# EAGLE design drums (EAGLE 9.6.2)
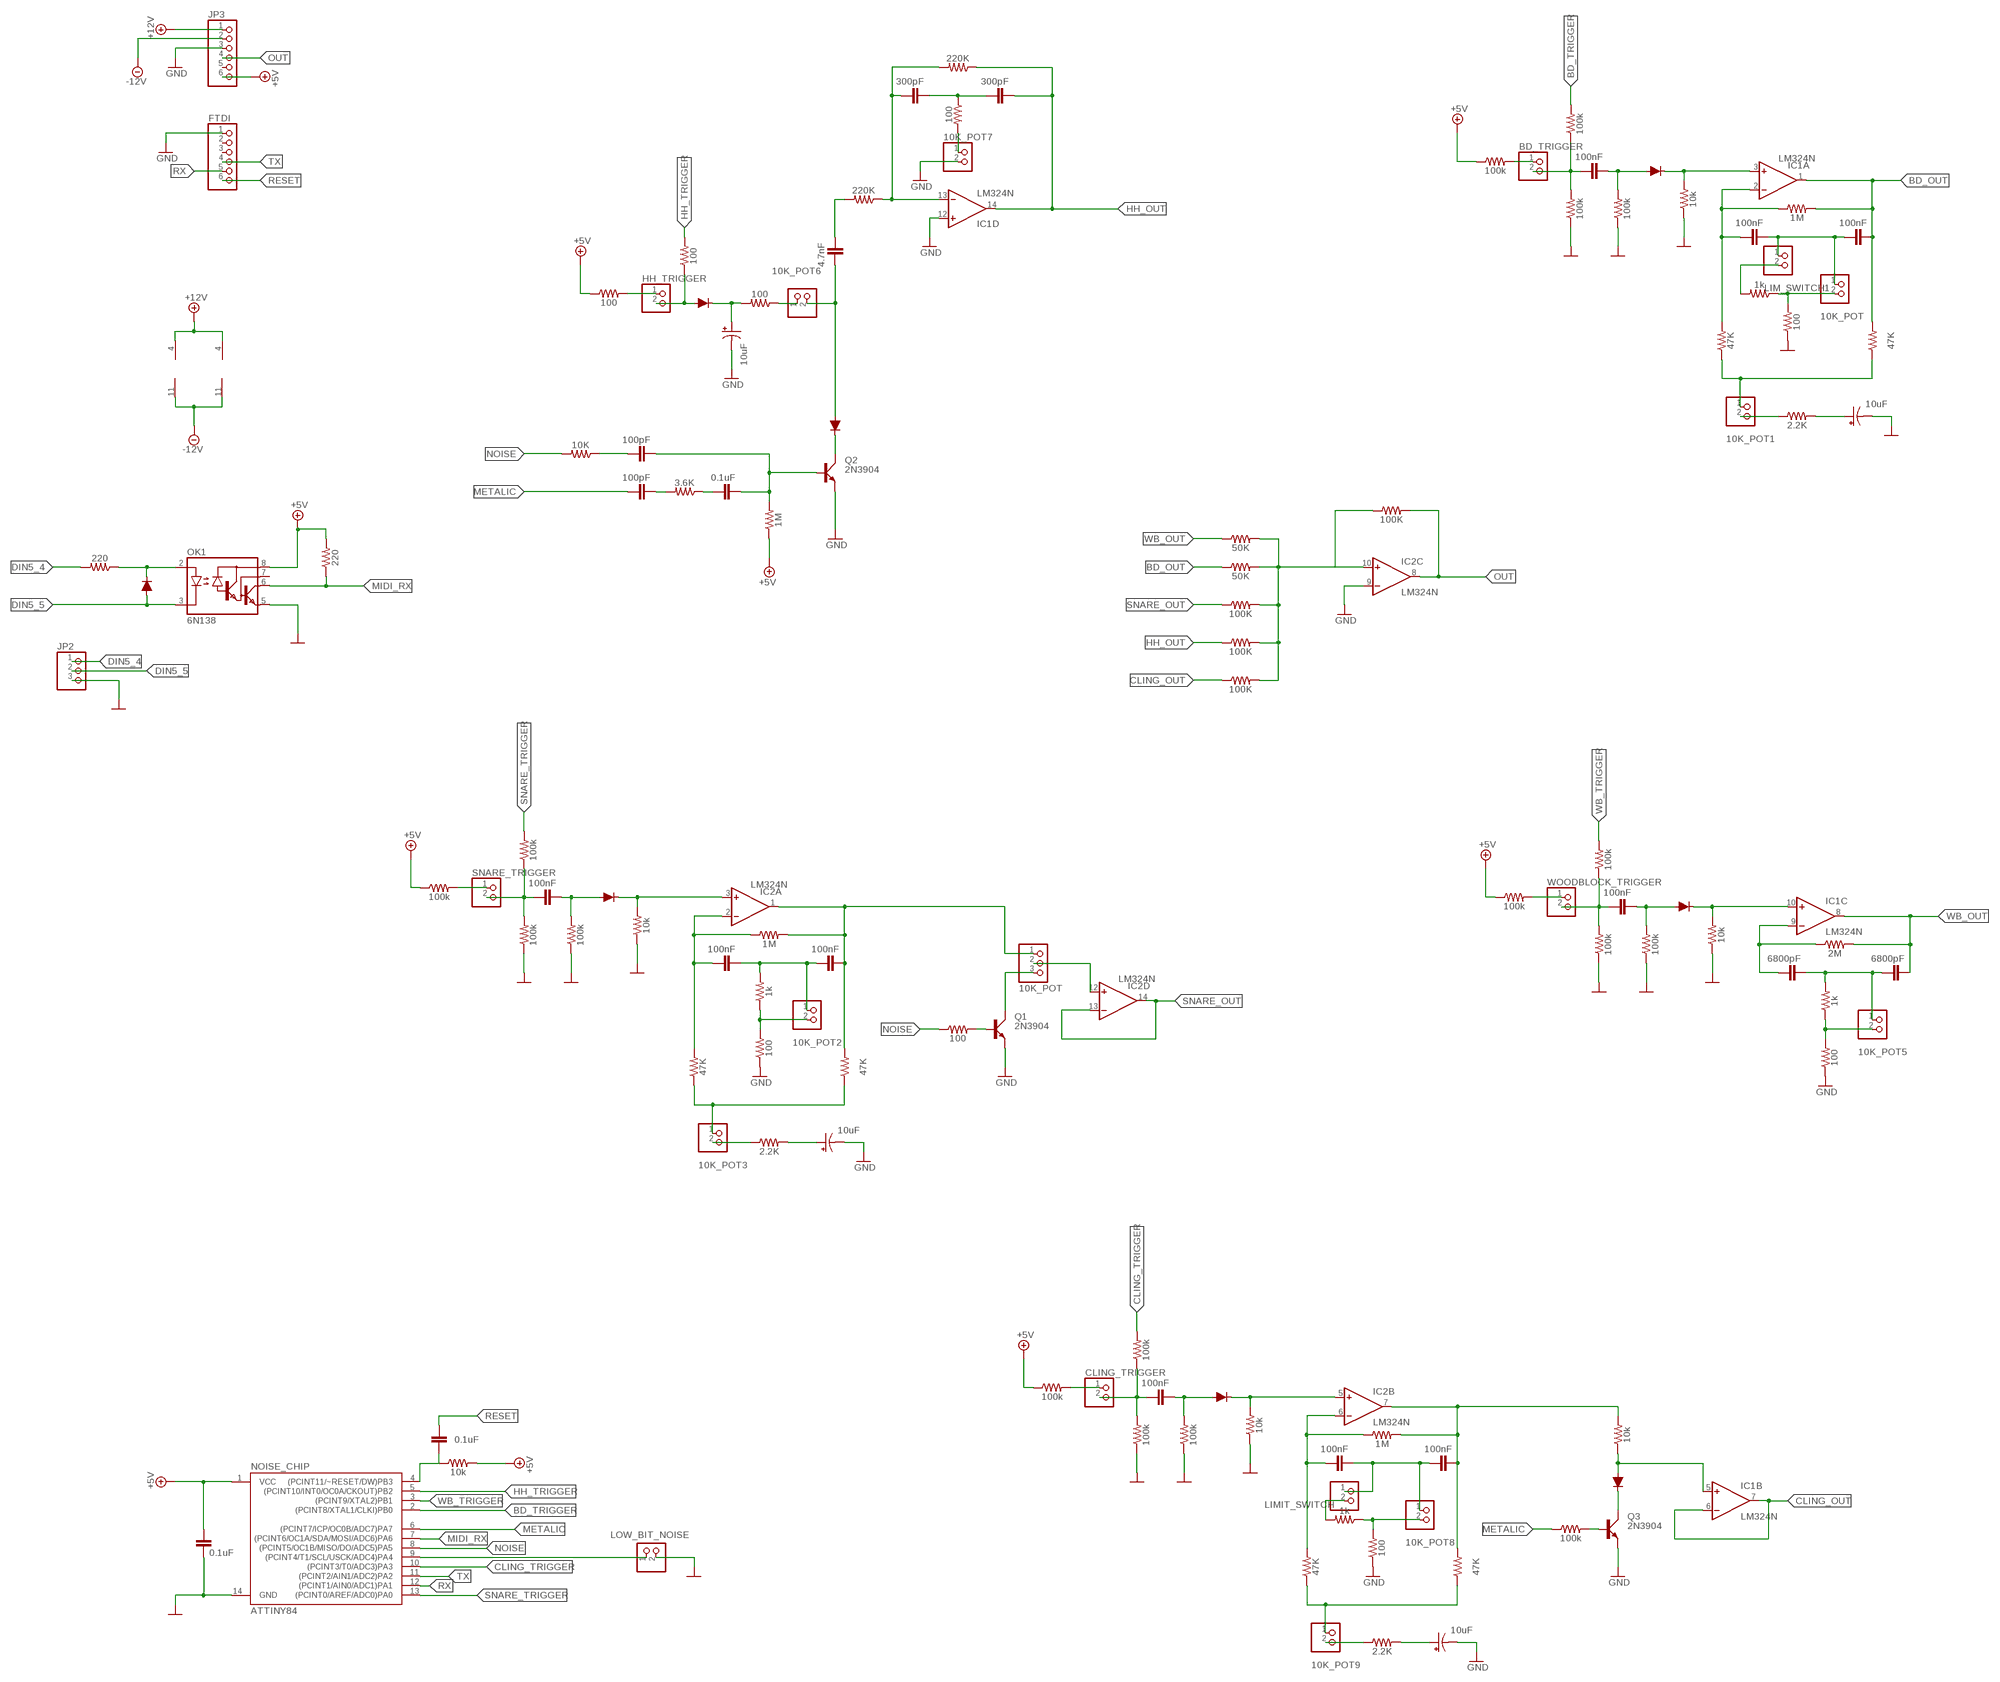
[diagram p0: schematic, sheet 1]

## Parts
1M  1M  100KOHM-HORIZ-1/4W-5%  [AXIAL-0.3]
1M1  220  100KOHM-HORIZ-1/4W-5%  [AXIAL-0.3]
1M2  220  100KOHM-HORIZ-1/4W-5%  [AXIAL-0.3]
10K_POT  PINHD-1X2  [1X02]
10K_POT1  PINHD-1X2  [1X02]
10K_POT2  PINHD-1X2  [1X02]
10K_POT3  PINHD-1X2  [1X02]
10K_POT4  10K_POT  PINHD-1X3  [1X03]
10K_POT5  PINHD-1X2  [1X02]
10K_POT6  PINHD-1X2  [1X02]
10K_POT7  PINHD-1X2  [1X02]
10K_POT8  PINHD-1X2  [1X02]
10K_POT9  PINHD-1X2  [1X02]
BD_TRIGGER  PINHD-1X2  [1X02]
C1  0.1uF  C5/3  [C5B3]
C2  100nF  C5/3  [C5B3]
C3  100nF  C5/3  [C5B3]
C4  0.1uF  C5/3  [C5B3]
C5  10uF  CPOL-USTT5D11  [TT5D11]
C6  100nF  C5/3  [C5B3]
C7  100nF  C5/3  [C5B3]
C8  10uF  CPOL-USTT5D11  [TT5D11]
C9  6800pF  C5/3  [C5B3]
C10  6800pF  C5/3  [C5B3]
C11  10uF  CPOL-USTT5D11  [TT5D11]
C12  0.1uF  C5/3  [C5B3]
C13  100pF  C5/3  [C5B3]
C14  100pF  C5/3  [C5B3]
C15  4.7nF  C5/3  [C5B3]
C16  300pF  C5/3  [C5B3]
C17  300pF  C5/3  [C5B3]
C18  100nF  C5/3  [C5B3]
C19  100nF  C5/3  [C5B3]
C20  100nF  C5/3  [C5B3]
C21  100nF  C5/3  [C5B3]
C22  100nF  C5/3  [C5B3]
C23  10uF  CPOL-USTT5D11  [TT5D11]
C24  100nF  C5/3  [C5B3]
CLING_TRIGGER  PINHD-1X2  [1X02]
D1  1A/50V/1.1V  DIODE-KIT2  [DIODE-1N4001-KIT]
D2  1A/50V/1.1V  DIODE-KIT2  [DIODE-1N4001-KIT]
D3  1A/50V/1.1V  DIODE-KIT2  [DIODE-1N4001-KIT]
D4  1A/50V/1.1V  DIODE-KIT2  [DIODE-1N4001-KIT]
D5  1A/50V/1.1V  DIODE-KIT2  [DIODE-1N4001-KIT]
D6  1A/50V/1.1V  DIODE-KIT2  [DIODE-1N4001-KIT]
D7  1A/50V/1.1V  DIODE-KIT2  [DIODE-1N4001-KIT]
D8  1A/50V/1.1V  DIODE-KIT2  [DIODE-1N4001-KIT]
FTDI  PINHD-1X6  [1X06]
HH_TRIGGER  PINHD-1X2  [1X02]
IC1  LM324N  [DIL14]
IC2  LM324N  [DIL14]
JP2  PINHD-1X3  [1X03]
JP3  PINHD-1X6  [1X06]
LIM_SWITCH1  PINHD-1X2  [1X02]
LIMIT_SWITCH  PINHD-1X2  [1X02]
LOW_BIT_NOISE  PINHD-1X2  [1X02]
NOISE_CHIP  ATTINY84  ATTINY84ATTINY84-20PU  [DIP14]
OK1  6N138  [DIL08]
Q1  2N3904  [TO92D]
Q2  2N3904  [TO92D]
Q3  2N3904  [TO92D]
R1  100k  100KOHM-HORIZ-1/4W-5%  [AXIAL-0.3]
R2  10k  100KOHM-HORIZ-1/4W-5%  [AXIAL-0.3]
R3  1M  100KOHM-HORIZ-1/4W-5%  [AXIAL-0.3]
R4  47K  100KOHM-HORIZ-1/4W-5%  [AXIAL-0.3]
R5  47K  100KOHM-HORIZ-1/4W-5%  [AXIAL-0.3]
R6  1k  100KOHM-HORIZ-1/4W-5%  [AXIAL-0.3]
R7  100  100KOHM-HORIZ-1/4W-5%  [AXIAL-0.3]
R8  2.2K  100KOHM-HORIZ-1/4W-5%  [AXIAL-0.3]
R9  50K  100KOHM-HORIZ-1/4W-5%  [AXIAL-0.3]
R10  100K  100KOHM-HORIZ-1/4W-5%  [AXIAL-0.3]
R11  100  100KOHM-HORIZ-1/4W-5%  [AXIAL-0.3]
R12  100k  100KOHM-HORIZ-1/4W-5%  [AXIAL-0.3]
R13  1M  100KOHM-HORIZ-1/4W-5%  [AXIAL-0.3]
R14  47K  100KOHM-HORIZ-1/4W-5%  [AXIAL-0.3]
R15  47K  100KOHM-HORIZ-1/4W-5%  [AXIAL-0.3]
R16  1k  100KOHM-HORIZ-1/4W-5%  [AXIAL-0.3]
R17  100  100KOHM-HORIZ-1/4W-5%  [AXIAL-0.3]
R18  2.2K  100KOHM-HORIZ-1/4W-5%  [AXIAL-0.3]
R19  100k  100KOHM-HORIZ-1/4W-5%  [AXIAL-0.3]
R20  100k  100KOHM-HORIZ-1/4W-5%  [AXIAL-0.3]
R21  100  100KOHM-HORIZ-1/4W-5%  [AXIAL-0.3]
R22  10k  100KOHM-HORIZ-1/4W-5%  [AXIAL-0.3]
R23  100k  100KOHM-HORIZ-1/4W-5%  [AXIAL-0.3]
R24  2M  100KOHM-HORIZ-1/4W-5%  [AXIAL-0.3]
R25  10k  100KOHM-HORIZ-1/4W-5%  [AXIAL-0.3]
R26  100  100KOHM-HORIZ-1/4W-5%  [AXIAL-0.3]
R27  1k  100KOHM-HORIZ-1/4W-5%  [AXIAL-0.3]
R28  100  100KOHM-HORIZ-1/4W-5%  [AXIAL-0.3]
R29  100  100KOHM-HORIZ-1/4W-5%  [AXIAL-0.3]
R30  100K  100KOHM-HORIZ-1/4W-5%  [AXIAL-0.3]
R31  50K  100KOHM-HORIZ-1/4W-5%  [AXIAL-0.3]
R32  3.6K  100KOHM-HORIZ-1/4W-5%  [AXIAL-0.3]
R33  10K  100KOHM-HORIZ-1/4W-5%  [AXIAL-0.3]
R34  220K  100KOHM-HORIZ-1/4W-5%  [AXIAL-0.3]
R35  220K  100KOHM-HORIZ-1/4W-5%  [AXIAL-0.3]
R36  100  100KOHM-HORIZ-1/4W-5%  [AXIAL-0.3]
R37  100K  100KOHM-HORIZ-1/4W-5%  [AXIAL-0.3]
R38  100k  100KOHM-HORIZ-1/4W-5%  [AXIAL-0.3]
R39  100k  100KOHM-HORIZ-1/4W-5%  [AXIAL-0.3]
R40  10k  100KOHM-HORIZ-1/4W-5%  [AXIAL-0.3]
R41  100k  100KOHM-HORIZ-1/4W-5%  [AXIAL-0.3]
R42  100k  100KOHM-HORIZ-1/4W-5%  [AXIAL-0.3]
R43  100k  100KOHM-HORIZ-1/4W-5%  [AXIAL-0.3]
R44  100k  100KOHM-HORIZ-1/4W-5%  [AXIAL-0.3]
R45  100k  100KOHM-HORIZ-1/4W-5%  [AXIAL-0.3]
R46  1M  100KOHM-HORIZ-1/4W-5%  [AXIAL-0.3]
R47  47K  100KOHM-HORIZ-1/4W-5%  [AXIAL-0.3]
R48  47K  100KOHM-HORIZ-1/4W-5%  [AXIAL-0.3]
R49  1k  100KOHM-HORIZ-1/4W-5%  [AXIAL-0.3]
R50  100  100KOHM-HORIZ-1/4W-5%  [AXIAL-0.3]
R51  2.2K  100KOHM-HORIZ-1/4W-5%  [AXIAL-0.3]
R52  100k  100KOHM-HORIZ-1/4W-5%  [AXIAL-0.3]
R53  10k  100KOHM-HORIZ-1/4W-5%  [AXIAL-0.3]
R54  100k  100KOHM-HORIZ-1/4W-5%  [AXIAL-0.3]
R55  100k  100KOHM-HORIZ-1/4W-5%  [AXIAL-0.3]
R56  100k  100KOHM-HORIZ-1/4W-5%  [AXIAL-0.3]
R57  100k  100KOHM-HORIZ-1/4W-5%  [AXIAL-0.3]
R58  100K  100KOHM-HORIZ-1/4W-5%  [AXIAL-0.3]
R59  10k  100KOHM-HORIZ-1/4W-5%  [AXIAL-0.3]
SNARE_TRIGGER  PINHD-1X2  [1X02]
WOODBLOCK_TRIGGER  PINHD-1X2  [1X02]

## Nets
10K_POT1: 10K_POT1.1 R4.P$1 R5.P$1
10K_POT2: 10K_POT3.1 R14.P$1 R15.P$1
10K_POT3: 10K_POT9.1 R47.P$1 R48.P$1
+5V: 1M1.P$2 1M.P$1 C1.1 JP3.6 NOISE_CHIP.1(VCC) OK1.8(VCC) R23.P$1 R25.P$2 R29.P$1 R38.P$1 R41.P$1 R54.P$1
+12V: IC1.4(P:V+) IC2.4(P:V+) JP3.1
-12V: IC1.11(P:V-) IC2.11(P:V-) JP3.2
BD_OUT: 10K_POT4.1 C3.2 C7.2 IC1.1(A:OUT) IC2.1(A:OUT) R3.P$2 R5.P$2 R13.P$2 R15.P$2 R31.P$1
BD_OUT1: C22.2 IC2.7(B:OUT) R46.P$2 R48.P$2 R59.P$2
BD_TRIGGER: NOISE_CHIP.2((PCINT8/XTAL1/CLKI)PB0) R12.P$2
CLING_OUT: IC1.6(B:-IN) IC1.7(B:OUT) R58.P$1
CLING_TRIGGER: NOISE_CHIP.10((PCINT3/T0/ADC3)PA3) R57.P$2
DIN5_4: 1M2.P$2 JP2.1
DIN5_5: D2.A JP2.2 OK1.3(C)
GND: 10K_POT7.2 C1.2 C5.- C8.- C11.- C23.- FTDI.1 IC1.12(D:+IN) IC2.9(C:-IN) JP2.3 JP3.3 LOW_BIT_NOISE.2 NOISE_CHIP.14(GND) OK1.5(GND) Q1.E Q2.E Q3.E R1.P$1 R2.P$1 R7.P$1 R17.P$1 R22.P$1 R28.P$1 R39.P$1 R40.P$1 R42.P$1 R43.P$1 R44.P$1 R45.P$1 R50.P$1 R53.P$1 R55.P$1 R56.P$1
HH_OUT: C17.2 IC1.14(D:OUT) R35.P$1 R37.P$1
HH_TRIGGER: NOISE_CHIP.5((PCINT10/INT0/OC0A/CKOUT)PB2) R11.P$2
METALIC: C14.1 NOISE_CHIP.6((PCINT7/ICP/OC0B/ADC7)PA7) R52.P$1
MIDI_RX: 1M1.P$1 NOISE_CHIP.7((PCINT6/OC1A/SDA/MOSI/ADC6)PA6) OK1.6(VO)
N$1: 10K_POT8.1 C21.2 C22.1 LIMIT_SWITCH.1
N$2: BD_TRIGGER.2 C18.1 R12.P$1 R39.P$2
N$3: D1.C IC1.3(A:+IN) R2.P$2
N$4: C18.2 D1.A R1.P$2
N$5: BD_TRIGGER.1 R38.P$2
N$6: 10K_POT.1 C2.2 C3.1 LIM_SWITCH1.1
N$7: C2.1 IC1.2(A:-IN) R3.P$1 R4.P$2
N$8: C21.1 IC2.6(B:-IN) R46.P$1 R47.P$2
N$9: 10K_POT.2 R6.P$1 R7.P$2
N$10: 10K_POT1.2 R8.P$1
N$11: C5.+ R8.P$2
N$12: 1M2.P$1 D2.C OK1.2(A)
N$13: 10K_POT8.2 R49.P$1 R50.P$2
N$14: 10K_POT9.2 R51.P$1
N$15: C19.1 R19.P$1 R42.P$2 WOODBLOCK_TRIGGER.2
N$16: 10K_POT2.1 C6.2 C7.1 R16.P$2
N$17: C6.1 IC2.2(A:-IN) R13.P$1 R14.P$2
N$18: 10K_POT2.2 R16.P$1 R17.P$2
N$19: 10K_POT3.2 R18.P$1
N$20: C8.+ R18.P$2
N$21: C23.+ R51.P$2
N$22: Q1.B R21.P$2
N$23: 10K_POT4.3 Q1.C
N$24: 10K_POT4.2 IC2.12(D:+IN)
N$25: C20.1 R20.P$1 R44.P$2 SNARE_TRIGGER.2
N$26: D3.C IC2.3(A:+IN) R22.P$2
N$27: R23.P$2 SNARE_TRIGGER.1
N$28: D6.C IC1.10(C:+IN) R40.P$2
N$29: 10K_POT5.1 C9.2 C10.1 R27.P$2
N$30: C9.1 IC1.9(C:-IN) R24.P$1
N$31: 10K_POT5.2 R27.P$1 R28.P$2
N$32: D4.A HH_TRIGGER.2 R11.P$1
N$33: C11.+ D4.C R26.P$2
N$34: IC2.10(C:+IN) R9.P$2 R10.P$2 R30.P$1 R31.P$2 R37.P$2 R58.P$2
N$35: 10K_POT6.1 R26.P$1
N$36: 10K_POT6.2 C15.1 D5.A
N$37: C4.2 NOISE_CHIP.4((PCINT11/~RESET/DW)PB3) R25.P$1
N$38: D5.C Q2.C
N$39: C12.1 R32.P$1
N$40: 1M.P$2 C12.2 C13.2 Q2.B
N$41: HH_TRIGGER.1 R29.P$2
N$42: C13.1 R33.P$1
N$43: C15.2 R34.P$2
N$44: C14.2 R32.P$2
N$45: 10K_POT7.1 R36.P$2
N$46: C16.2 C17.1 R36.P$1
N$47: R41.P$2 WOODBLOCK_TRIGGER.1
N$48: C16.1 IC1.13(D:-IN) R34.P$1 R35.P$2
N$49: C19.2 D6.A R43.P$2
N$50: C20.2 D3.A R45.P$2
N$51: Q3.B R52.P$2
N$52: D8.C Q3.C
N$53: D8.A IC1.5(B:+IN) R59.P$1
N$54: C24.1 CLING_TRIGGER.2 R55.P$2 R57.P$1
N$55: D7.C IC2.5(B:+IN) R53.P$2
N$56: CLING_TRIGGER.1 R54.P$2
N$57: C24.2 D7.A R56.P$2
N$58: LIM_SWITCH1.2 R6.P$2
N$59: LIMIT_SWITCH.2 R49.P$2
N$60: LOW_BIT_NOISE.1 NOISE_CHIP.9((PCINT4/T1/SCL/USCK/ADC4)PA4)
NOISE: NOISE_CHIP.8((PCINT5/OC1B/MISO/DO/ADC5)PA5) R21.P$1 R33.P$2
OUT: IC2.8(C:OUT) JP3.4 R30.P$2
RESET: C4.1 FTDI.6
RX: FTDI.5 NOISE_CHIP.12((PCINT1/AIN0/ADC1)PA1)
SNARE_OUT: IC2.13(D:-IN) IC2.14(D:OUT) R10.P$1
SNARE_TRIGGER: NOISE_CHIP.13((PCINT0/AREF/ADC0)PA0) R20.P$2
TX: FTDI.4 NOISE_CHIP.11((PCINT2/AIN1/ADC2)PA2)
WB_OUT: C10.2 IC1.8(C:OUT) R9.P$1 R24.P$2
WB_TRIGGER: NOISE_CHIP.3((PCINT9/XTAL2)PB1) R19.P$2
Unconnected: FTDI.2 FTDI.3 JP3.5 OK1.7(VB)

## Library data of the parts
1M 1M1 1M2 R2-R11 R13-R18 R21 R22 R24-R37 R40 R46-R51 R53 R58 R59 = SparkFun-Resistors:100KOHM: 100kΩ resistor A resistor is a passive two-terminal electrical component that implements electrical resistance as a circuit element. Resistors act to reduce current flow, and, at the same time, act to lower voltage levels within circuits. - Wikipedia; PROD_ID: RES-10686; VALUE: 100k
10K_POT 10K_POT1-10K_POT3 10K_POT5-10K_POT9 BD_TRIGGER CLING_TRIGGER HH_TRIGGER LIM_SWITCH1 LIMIT_SWITCH LOW_BIT_NOISE SNARE_TRIGGER WOODBLOCK_TRIGGER = pinhead:PINHD-1X2: PIN HEADER
10K_POT4 = pinhead:PINHD-1X3: PIN HEADER
C1-C4 C6 C7 C9 C10 C12-C22 C24 = capacitor-wima:C: CAPACITOR naming: grid - package width
C5 C8 C11 C23 = rcl:CPOL-US: POLARIZED CAPACITOR, American symbol; SPICEPREFIX: C
D1-D8 = SparkFun-DiscreteSemi:DIODE: Diode These are standard reverse protection diodes and small signal diodes. SparkFun Products: SparkFun SparkPunk Sound Kit <https://www.sparkfun.com/products/11177> SparkFun ESP8266 Thing <https://www.sparkfun.com/products/13231>; PROD_ID: DIO-09176
FTDI JP3 = pinhead:PINHD-1X6: PIN HEADER
IC1 IC2 = linear:LM324: OP AMP
JP2 = adafruit:PINHD-1X3: PIN HEADER
NOISE_CHIP = SparkFun-IC-Microcontroller:ATTINY84: Atmel 14-pin 2/4/8kB flash uC Datasheet <https://cdn.sparkfun.com/datasheets/Widgets/doc8006.pdf> SparkFun Products Tiny AVR Programmer <https://www.sparkfun.com/products/11801> (PGM-11801) SparkFun Servo Trigger - Continuous Rotation <https://www.sparkfun.com/products/13872> (WIG-13872) SparkFun Servo Trigger <https://www.sparkfun.com/products/13118> (WIG-13118)
OK1 = optocoupler:6N138: MOTOROLA OPTO COUPLER; MF: VISHAY/TELEFUNKEN; MPN: 6N138; OC_FARNELL: 9860150; OC_NEWARK: 35K5294
Q1-Q3 = transistor-small-signal:2N3904: NPN TRANSISTOR
R1 R12 R19 R20 R23 R38 R39 R41-R45 R52 R54-R57 = SparkFun-Resistors:100KOHM: 100kΩ resistor A resistor is a passive two-terminal electrical component that implements electrical resistance as a circuit element. Resistors act to reduce current flow, and, at the same time, act to lower voltage levels within circuits. - Wikipedia; PROD_ID: RES-10686

## Board
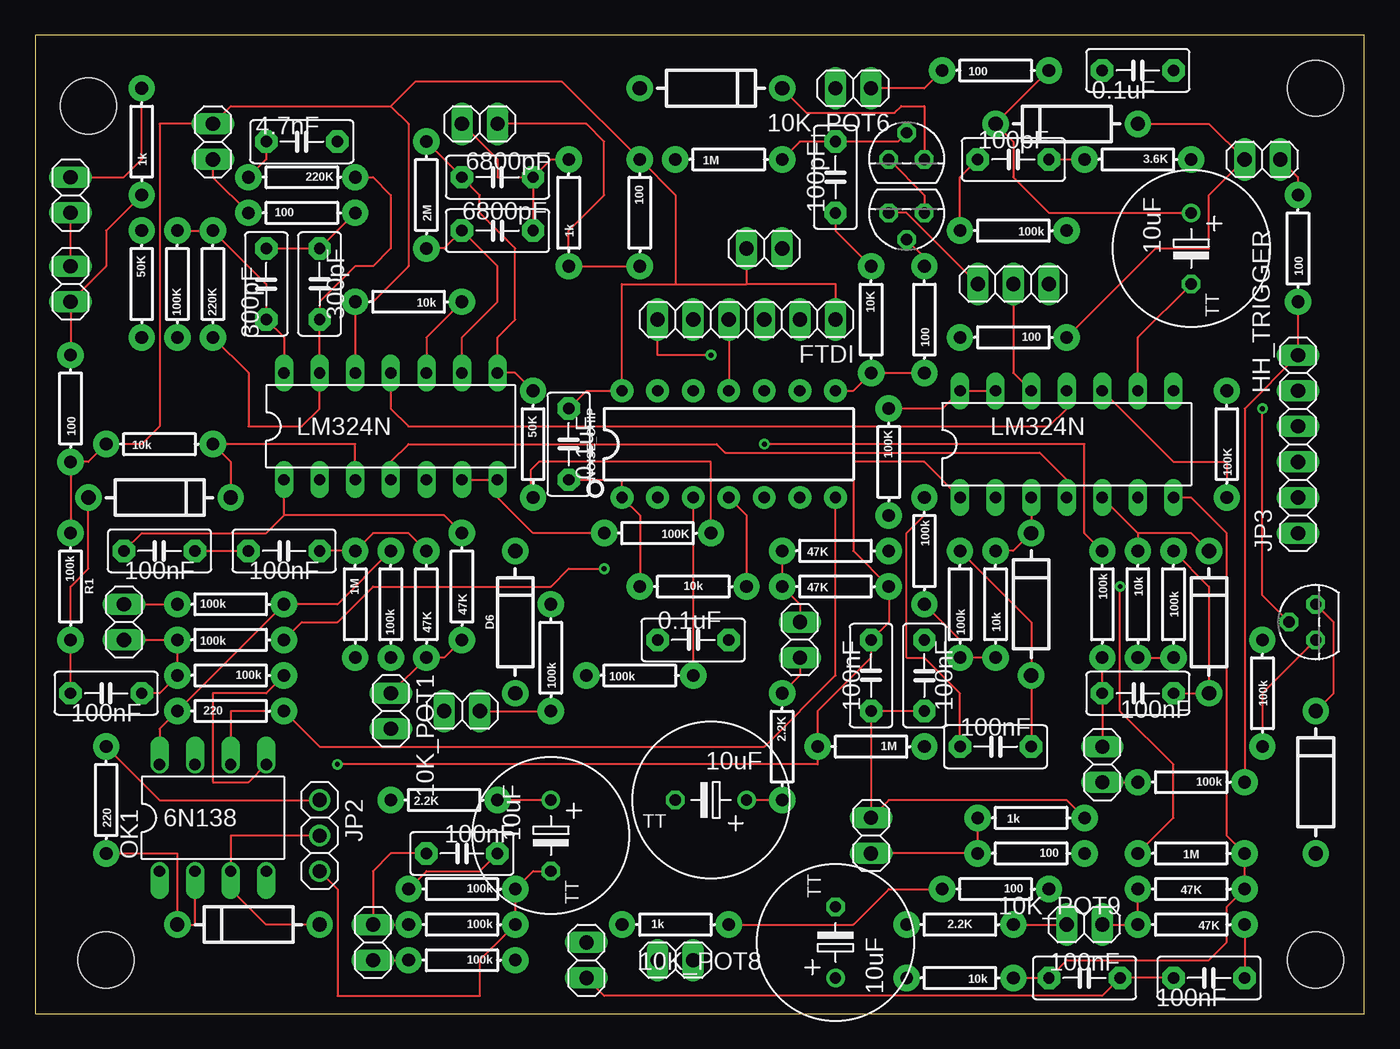
[diagram p1: board, top side]
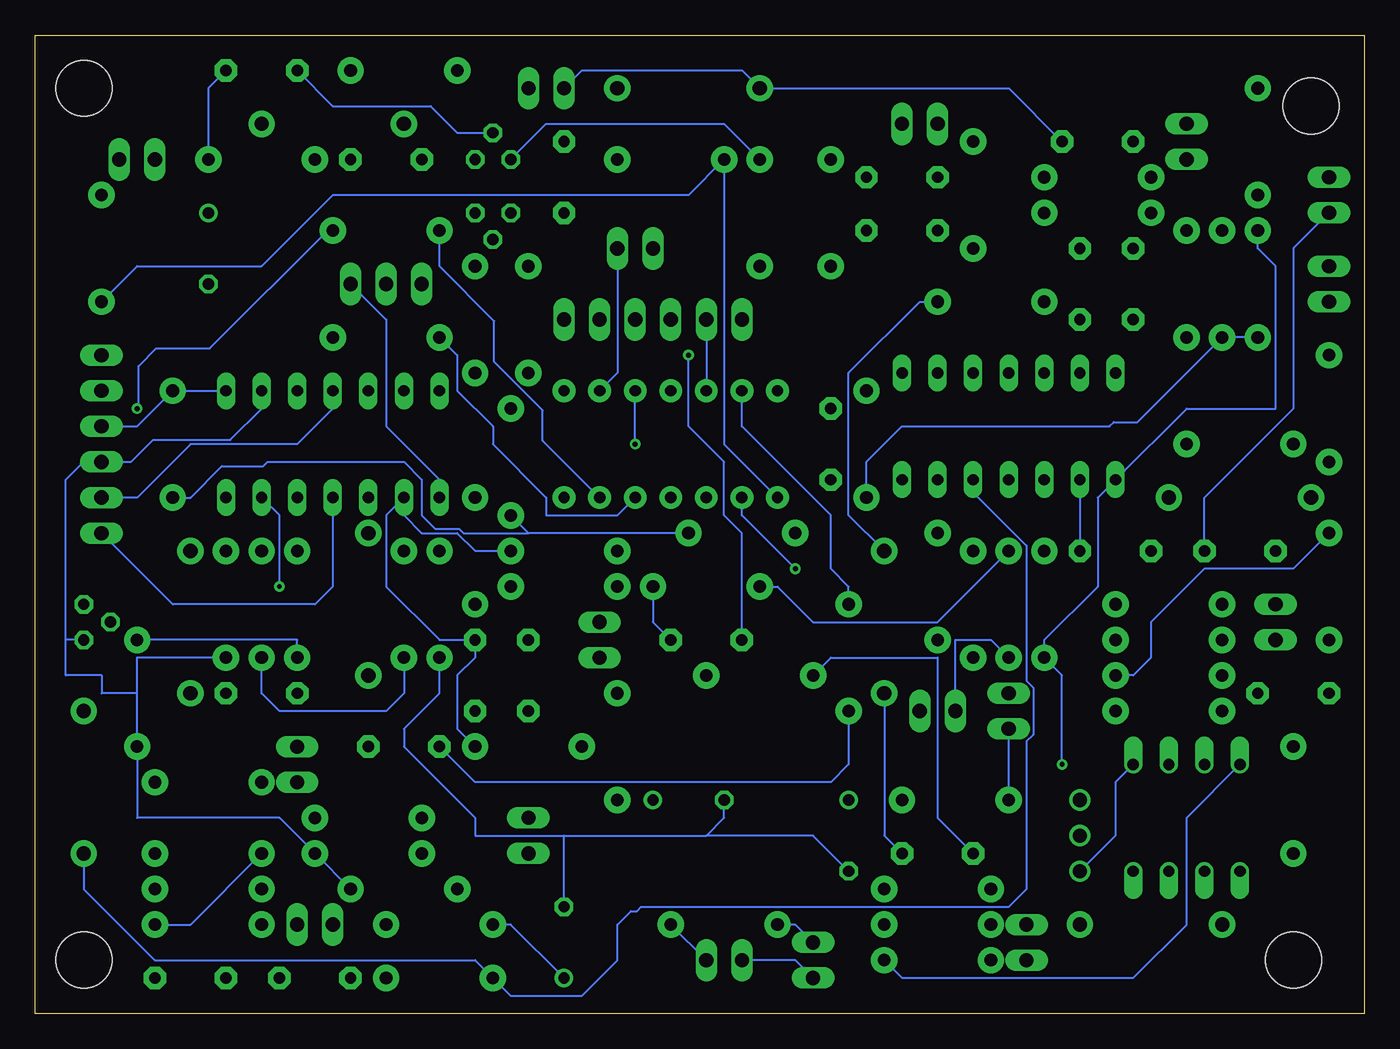
[diagram p2: board, bottom side, seen from below]

Size 94.92 x 69.84 mm. Coordinates in mm from the lower left corner, seen from the top.
Outline: 0,0 94.92,0 94.92,69.84 0,69.84 0,0
Copper layers (1*16): Top 0.035mm / dielectric 1.5mm / Bottom 0.035mm
Design rules "default": minimum track width 6mil, minimum drill 0.35mm, track to track 6mil, track to pad 6mil, pad to pad 6mil, via to via 6mil, smd to smd 6mil, copper to edge 40mil, drill to drill 6mil, minimum pad ring 10mil, minimum via ring 8mil, stop-mask expansion 4mil, vias tented up to drill 0mil, thermal gap 10mil
Holes 4 mm at 5.08,3.81 3.81,64.77 91.44,66.04 91.44,3.81

### Footprints (pad centres in the part's own frame; a part is rotated, then mirrored left to right if it is on the bottom)
AXIAL-0.3 = drill 0.9 pad 1.88: P$1 -3.81,0; P$2 3.81,0
1X02 = drill 1.016 long: 1 -1.27,0; 2 1.27,0
1X03 = drill 1.016 long: 1 -2.54,0; 2 0,0; 3 2.54,0
C5B3 = drill 0.813 pad 1.6 octagon: 1 -2.54,0; 2 2.54,0
TT5D11 = drill 0.813: + -2.54,0 | drill 0.813 octagon: - 2.54,0
DIODE-1N4001-KIT = drill 1.016 pad 1.88: A -5.08,0; C 5.08,0
1X06 = drill 1.016 long: 1 -6.35,0; 2 -3.81,0; 3 -1.27,0; 4 1.27,0; 5 3.81,0; 6 6.35,0
DIL14 = drill 0.813 long: 1 -7.62,-3.81; 2 -5.08,-3.81; 3 -2.54,-3.81; 4 0,-3.81; 5 2.54,-3.81; 6 5.08,-3.81; 7 7.62,-3.81; 8 7.62,3.81; 9 5.08,3.81; 10 2.54,3.81; 11 0,3.81; 12 -2.54,3.81; 13 -5.08,3.81; 14 -7.62,3.81
1X03' = drill 1.016: 1 -2.54,0; 2 0,0; 3 2.54,0
DIP14 = drill 0.813 pad 1.626: 1 -7.62,-3.81; 2 -5.08,-3.81; 3 -2.54,-3.81; 4 0,-3.81; 5 2.54,-3.81; 6 5.08,-3.81; 7 7.62,-3.81; 8 7.62,3.81; 9 5.08,3.81; 10 2.54,3.81; 11 0,3.81; 12 -2.54,3.81; 13 -5.08,3.81; 14 -7.62,3.81
DIL08 = drill 0.813 offset: 1 -3.81,-3.81; 2 -1.27,-3.81; 3 1.27,-3.81; 4 3.81,-3.81; 5 3.81,3.81; 6 1.27,3.81; 7 -1.27,3.81; 8 -3.81,3.81
TO92D = drill 0.813 octagon: B 0,1.905; C 1.27,0; E -1.27,0

### Placement (x,y rotation side)
1M  49.53,60.96 0 top
1M1  13.97,21.59 180 top
1M2  5.08,15.24 90 top
10K_POT  2.54,52.07 270 top
10K_POT1  25.4,21.59 270 top
10K_POT2  59.69,12.7 270 top
10K_POT3  54.61,26.67 270 top
10K_POT4  69.85,52.07 180 top
10K_POT5  31.75,63.5 0 top
10K_POT6  58.42,66.04 180 top
10K_POT7  12.7,62.23 90 top
10K_POT8  45.72,3.81 0 top
10K_POT9  74.93,6.35 180 top
BD_TRIGGER  6.35,27.94 270 top
C1  38.1,40.64 90 top
C2  17.78,33.02 180 top
C3  8.89,33.02 180 top
C4  46.99,26.67 0 top
C5  36.83,12.7 270 top
C6  63.5,24.13 270 top
C7  59.69,24.13 90 top
C8  48.26,15.24 180 top
C9  33.02,55.88 0 top
C10  33.02,59.69 180 top
C11  82.55,54.61 270 top
C12  78.74,67.31 180 top
C13  57.15,59.69 90 top
C14  69.85,60.96 0 top
C15  19.05,62.23 180 top
C16  20.32,52.07 90 top
C17  16.51,52.07 270 top
C18  5.08,22.86 180 top
C19  30.48,11.43 0 top
C20  68.58,19.05 0 top
C21  83.82,2.54 180 top
C22  74.93,2.54 180 top
C23  57.15,5.08 90 top
C24  78.74,22.86 0 top
CLING_TRIGGER  76.2,17.78 90 top
D1  8.89,36.83 0 top
D2  15.24,6.35 180 top
D3  71.12,29.21 90 top
D4  73.66,63.5 180 top
D5  48.26,66.04 0 top
D6  34.29,27.94 90 top
D7  83.82,27.94 90 top
D8  91.44,16.51 90 top
FTDI  50.8,49.53 180 top
HH_TRIGGER  87.63,60.96 180 top
IC1  25.4,41.91 0 top
IC2  73.66,40.64 0 top
JP2  [1X03']  20.32,12.7 270 top
JP3  90.17,40.64 90 top
LIM_SWITCH1  2.54,58.42 90 top
LIMIT_SWITCH  39.37,3.81 90 top
LOW_BIT_NOISE  52.07,54.61 180 top
NOISE_CHIP  49.53,40.64 0 top
OK1  12.7,13.97 0 top
Q1  62.23,57.15 180 top
Q2  62.23,60.96 0 top
Q3  91.44,27.94 90 top
R1  2.54,30.48 270 top
R2  8.89,40.64 0 top
R3  22.86,29.21 270 top
R4  27.94,29.21 90 top
R5  30.48,30.48 90 top
R6  7.62,62.23 90 top
R7  2.54,43.18 90 top
R8  29.21,15.24 0 top
R9  35.56,40.64 270 top
R10  60.96,39.37 270 top
R11  69.85,48.26 180 top
R12  13.97,26.67 0 top
R13  59.69,19.05 180 top
R14  57.15,33.02 0 top
R15  57.15,30.48 0 top
R16  71.12,13.97 0 top
R17  71.12,11.43 180 top
R18  53.34,19.05 270 top
R19  43.18,24.13 0 top
R20  36.83,25.4 90 top
R21  63.5,49.53 90 top
R22  68.58,29.21 90 top
R23  25.4,29.21 270 top
R24  27.94,58.42 90 top
R25  46.99,30.48 180 top
R26  68.58,67.31 0 top
R27  38.1,57.15 90 top
R28  43.18,57.15 270 top
R29  90.17,54.61 90 top
R30  85.09,40.64 90 top
R31  7.62,52.07 270 top
R32  78.74,60.96 180 top
R33  59.69,49.53 270 top
R34  19.05,59.69 180 top
R35  12.7,52.07 270 top
R36  19.05,57.15 180 top
R37  10.16,52.07 270 top
R38  13.97,29.21 180 top
R39  13.97,24.13 180 top
R40  26.67,50.8 0 top
R41  30.48,3.81 180 top
R42  30.48,6.35 180 top
R43  30.48,8.89 180 top
R44  63.5,33.02 90 top
R45  66.04,29.21 90 top
R46  82.55,11.43 0 top
R47  82.55,6.35 0 top
R48  82.55,8.89 0 top
R49  45.72,6.35 180 top
R50  68.58,8.89 180 top
R51  66.04,6.35 180 top
R52  69.85,55.88 0 top
R53  78.74,29.21 90 top
R54  82.55,16.51 180 top
R55  87.63,22.86 90 top
R56  81.28,29.21 90 top
R57  76.2,29.21 90 top
R58  44.45,34.29 0 top
R59  66.04,2.54 0 top
SNARE_TRIGGER  30.48,21.59 0 top
WOODBLOCK_TRIGGER  24.13,5.08 90 top

### Tracks (layer width: path | path; a pad name or v marks a point on that pad's centre or on a via)
10K_POT1
  Top 0.152: R5.P$1 29.21,25.4 R4.P$1 10K_POT1.1
10K_POT2
  Top 0.152: R14.P$1 R15.P$1 54.61,29.21 10K_POT3.1
10K_POT3
  Top 0.152: R48.P$1 R47.P$1 10K_POT9.1
+5V
  Top 0.152: R25.P$2 43.18,35.56 NOISE_CHIP.1 41.91,38.1 C1.1 | OK1.8 8.89,20.32 1M1.P$2 R38.P$1 21.59,29.21 R23.P$1 | R54.P$1 86.36,43.18 JP3.6 R29.P$1
  Bottom 0.152: R25.P$2 41.91,30.48 39.37,27.94 30.48,27.94 R23.P$1 | R29.P$1 87.63,53.34 78.74,53.34 73.66,58.42 48.26,58.42 1M.P$1 45.72,40.64 NOISE_CHIP.1 | R41.P$1 33.02,2.54 16.51,2.54 12.7,6.35 12.7,13.97 OK1.8
+12V
  Top 0.152: IC1.4 25.4,39.37 26.67,40.64 48.67,40.64 49.28,40.03 71.73,40.03 73.66,38.1 IC2.4
  Bottom 0.152: IC2.4 73.66,30.48 74.93,29.21 85.09,29.21 JP3.1
-12V
  Top 0.152: IC1.11 25.4,43.18 26.67,41.91 72.39,41.91 73.66,43.18 IC2.11
  Bottom 0.152: IC2.11 73.66,43.18 76.2,40.64 83.82,40.64 87.63,36.83 JP3.2
BD_OUT  (via drill 0.35)
  Top 0.152: C3.2 7.62,34.29 16.51,34.29 17.78,35.56 | 17.78,35.56 IC1.1 | IC2.1 63.5,39.37 58.42,39.37 58.42,33.02 R15.P$2 60.96,27.94 C7.2 59.69,25.4 55.88,21.59 R13.P$2 55.88,17.78 v21.59,17.78 | R5.P$2 29.21,35.56 17.78,35.56
  Bottom 0.152: R31.P$1 7.62,54.61 6.35,53.34 6.35,43.18 12.7,43.18 IC1.1 19.05,36.83 19.05,30.48 22.86,26.67 R3.P$2 21.59,24.13 v21.59,17.78 | 10K_POT4.1 69.85,49.53 69.85,41.91 66.04,38.1 IC2.1
BD_OUT1
  Top 0.152: IC2.7 82.55,36.83 85.09,34.29 85.09,12.7 R46.P$2 R48.P$2 85.09,7.62 85.09,5.08 83.82,3.81 73.66,3.81 C22.2 R59.P$2
BD_TRIGGER  (via drill 0.35)
  Top 0.152: R12.P$2 19.05,27.94 21.59,27.94 24.13,30.48 36.83,30.48 38.1,31.75 v40.64,31.75
  Bottom 0.152: NOISE_CHIP.2 44.45,35.56 v40.64,31.75
CLING_OUT
  Top 0.152: IC1.6 IC1.7 33.02,36.83 35.56,34.29 R58.P$1
CLING_TRIGGER  (via drill 0.35)
  Top 0.152: R57.P$2 74.93,34.29 74.93,40.64 v52.07,40.64
  Bottom 0.152: v52.07,40.64 NOISE_CHIP.10
DIN5_4
  Top 0.152: 1M2.P$2 8.89,15.24 JP2.1
DIN5_5
  Top 0.152: JP2.2 13.97,12.7 OK1.3 13.97,8.89 16.51,6.35 D2.A
GND
  Top 0.152: R53.P$1 R56.P$1 | R1.P$1 R7.P$1 3.81,39.37 R2.P$1 7.62,40.64 8.89,41.91 8.89,63.5 10K_POT7.2 13.97,64.77 25.4,64.77 | R39.P$1 16.51,22.86 12.7,22.86 12.7,16.51 15.24,16.51 OK1.5 | C1.2 39.37,44.45 NOISE_CHIP.14 41.91,52.07 45.72,52.07 | C5.- 35.56,10.16 R43.P$1 R42.P$1 31.75,3.81 31.75,1.27 21.59,1.27 21.59,8.89 JP2.3 | R22.P$1 R45.P$1 66.04,26.67 R44.P$1 | 25.4,64.77 26.67,63.5 26.67,53.34 24.13,50.8 R40.P$1 IC1.12 | 45.72,52.07 50.8,52.07 | 50.8,52.07 57.15,52.07 FTDI.1 | LOW_BIT_NOISE.2 50.8,52.07 | Q2.E 63.5,58.42 Q1.E | 25.4,64.77 27.15,66.52 37.62,66.52 R28.P$1 45.72,58.42 45.72,52.07 | IC2.9 78.74,48.26 C11.- | R55.P$1 87.63,22.86 Q3.E
  Bottom 0.152: R22.P$1 68.58,22.86 69.85,21.59 77.47,21.59 78.74,22.86 R53.P$1 | 92.71,26.67 92.71,24.13 90.17,24.13 90.17,22.86 87.63,22.86 | 92.71,26.67 92.71,38.1 91.44,39.37 JP3.3 88.06,39.37 86.49,40.95 80.97,40.95 78.74,43.18 IC2.9 | R56.P$1 87.63,25.4 87.63,22.86 | R45.P$1 66.04,22.86 68.58,20.32 68.58,19.05 63.5,13.97 63.5,12.7 57.15,12.7 | 87.63,22.86 R55.P$1 87.63,13.97 77.47,13.97 R17.P$1 R50.P$1 | C23.- 57.15,12.7 | 57.15,12.7 46.99,12.7 | 46.99,12.7 45.72,13.97 C8.- | Q2.E 58.42,63.5 45.72,63.5 R28.P$1 | C5.- 39.37,12.7 46.99,12.7 | OK1.5 17.78,16.51 17.78,12.7 JP2.3 | R1.P$1 5.08,31.75 11.43,31.75 15.24,27.94 15.24,25.4 16.51,24.13 R39.P$1 | Q3.E 92.71,26.67
HH_OUT
  Top 0.152: IC1.14 17.78,48.26 C17.2 16.51,52.07 R35.P$1 R37.P$1
HH_TRIGGER
  Bottom 0.152: R11.P$2 64.77,46.99 64.77,44.45 62.23,41.91 62.23,40.64 58.42,36.83 58.42,35.56 53.34,35.56 NOISE_CHIP.5
METALIC
  Top 0.152: R52.P$1 66.04,59.69 C14.1
  Bottom 0.152: NOISE_CHIP.6 58.68,40.9 58.68,43.05 62.13,46.51 62.13,49.43 66.04,53.34 R52.P$1
MIDI_RX
  Top 0.152: OK1.6 13.97,21.59 1M1.P$1 20.32,19.05 52.07,19.05 57.15,24.13 NOISE_CHIP.7
N$1
  Top 0.152: C21.2 C22.1 76.2,1.27 40.64,1.27 LIMIT_SWITCH.1
  Bottom 0.152: LIMIT_SWITCH.1 40.64,3.81 10K_POT8.1
N$2
  Top 0.152: BD_TRIGGER.2 R12.P$1 R39.P$2 8.89,22.86 C18.1
N$3
  Top 0.152: D1.C 13.97,39.37 R2.P$2 22.86,40.64 IC1.3
N$4
  Top 0.152: C18.2 R1.P$2 2.54,30.48 3.81,31.75 D1.A
N$5
  Top 0.152: BD_TRIGGER.1 R38.P$2
N$6
  Top 0.152: 10K_POT.1 LIM_SWITCH1.1 | C3.1 C2.2
  Bottom 0.152: LIM_SWITCH1.1 5.08,54.61 5.08,43.18 11.43,36.83 C3.1
N$7
  Top 0.152: C2.1 R3.P$1 24.13,34.29 26.67,34.29 R4.P$2
  Bottom 0.152: IC1.2 C2.1
N$8  (via drill 0.35)
  Top 0.152: R47.P$2 C21.1 | R46.P$1 81.28,13.97 81.28,17.78 77.47,21.59 v77.47,30.48
  Bottom 0.152: v77.47,30.48 77.47,35.56 IC2.6 | R47.P$2 83.82,6.35 R46.P$1
N$9
  Top 0.152: R6.P$1 5.08,55.88 5.08,53.34 10K_POT.2 R7.P$2
N$10
  Bottom 0.152: R8.P$1 10K_POT1.2
N$11
  Top 0.152: C5.+ R8.P$2
N$12
  Top 0.152: OK1.2 11.43,6.35 D2.C 10.16,11.43 1M2.P$1
N$13
  Top 0.152: R49.P$1 58.42,6.35 60.96,8.89 R50.P$2
  Bottom 0.152: R49.P$1 10K_POT8.2
N$14
  Top 0.152: R51.P$1 10K_POT9.2
N$15
  Top 0.152: R42.P$2 WOODBLOCK_TRIGGER.2 24.13,10.16 25.4,11.43 C19.1
  Bottom 0.152: R19.P$1 38.1,25.4 30.48,25.4 30.48,13.97 C19.1
N$16
  Top 0.152: C6.2 C7.1 10K_POT2.1 60.96,15.24 73.66,15.24 R16.P$2
N$17
  Bottom 0.152: R14.P$2 63.5,33.02 64.77,34.29 67.31,34.29 68.58,35.56 IC2.2 69.85,35.56 69.85,30.48 66.04,26.67 C6.1 63.5,25.4 64.77,24.13 64.77,20.32 R13.P$1
N$18
  Top 0.152: 10K_POT2.2 R17.P$2 R16.P$1
N$19
  Top 0.152: 10K_POT3.2 54.61,24.13 R18.P$1
N$20
  Top 0.152: R18.P$2 C8.+
N$21
  Bottom 0.152: C23.+ 60.96,6.35 R51.P$2
N$22
  Top 0.152: R21.P$2 63.5,53.98 Q1.B
N$23
  Top 0.152: 10K_POT4.3 62.23,57.15 Q1.C
N$24
  Top 0.152: IC2.12 69.85,45.72 10K_POT4.2
N$25
  Top 0.152: SNARE_TRIGGER.2 R20.P$1 | C20.1 66.04,22.86 63.5,25.4 62.23,25.4 62.23,34.29 63.5,35.56 R44.P$2
  Bottom 0.152: R20.P$1 36.83,17.78 38.1,16.51 63.5,16.51 C20.1
N$26
  Top 0.152: IC2.3 D3.C 69.85,33.02 R22.P$2
N$27
  Bottom 0.152: SNARE_TRIGGER.1 29.21,26.67 26.67,26.67 R23.P$2
N$28
  Top 0.152: R40.P$2 27.94,48.26 IC1.10
  Bottom 0.152: D6.C 36.83,35.56 36.83,45.72 31.75,50.8 R40.P$2
N$29
  Top 0.152: 10K_POT5.1 33.02,60.96 33.02,59.69 C10.1 | C10.1 C9.2 | C10.1 36.83,60.96 R27.P$2
N$30
  Top 0.152: IC1.9 30.48,48.26 33.02,50.8 33.02,53.34 C9.1 29.21,54.61 R24.P$1
N$31
  Top 0.152: R28.P$2 R27.P$1 38.1,55.88 40.64,58.42 40.64,62.23 39.37,63.5 10K_POT5.2
N$32
  Top 0.152: D4.A 83.82,63.5 HH_TRIGGER.2 83.82,58.42 83.82,54.61 80.01,54.61 R11.P$1
N$33
  Top 0.152: R26.P$2 D4.C 69.85,62.23 69.85,59.69 72.39,57.15 C11.+
N$34
  Top 0.152: IC2.10 81.28,39.37 85.09,39.37 R30.P$1 | R58.P$2 48.26,39.37 35.99,39.37 35.39,38.77 35.39,37 R9.P$2
  Bottom 0.152: R9.P$2 35.56,39.37 33.02,41.91 18.21,41.91 17.91,42.22 16.21,42.22 R37.P$2 R31.P$2 | R58.P$2 59.69,34.29 | 59.69,34.29 R10.P$2 | R30.P$1 83.82,36.83 81.59,39.06 78.61,39.06 78.31,39.37 68.58,39.37 67.31,38.1 67.31,35.56 66.34,34.59 64.64,34.59 64.34,34.29 59.69,34.29
N$35
  Top 0.152: R26.P$1 63.5,66.04 10K_POT6.1
N$36
  Bottom 0.152: 10K_POT6.2 55.88,67.31 44.45,67.31 D5.A 25.4,66.04 C15.1
N$37
  Top 0.152: NOISE_CHIP.4 50.8,35.56 R25.P$1
  Bottom 0.152: R25.P$1 50.8,27.94 C4.2
N$38
  Top 0.152: D5.C 55.09,64.29 61.37,64.29 61.85,64.77 63.5,64.77 Q2.C
N$39
  Bottom 0.152: C12.1 82.55,66.04 R32.P$1
N$40
  Top 0.152: Q2.B 61.6,62.23 C13.2 54.61,62.23 1M.P$2
  Bottom 0.152: C12.2 73.66,64.77 66.68,64.77 64.77,62.87 Q2.B
N$41
  Top 0.152: HH_TRIGGER.1 90.17,59.69 R29.P$2
N$42
  Top 0.152: C13.1 57.15,55.88 R33.P$1
N$43
  Top 0.152: C15.2 16.51,60.96 R34.P$2
N$44
  Top 0.152: C14.2 R32.P$2
N$45
  Top 0.152: 10K_POT7.1 12.7,59.69 R36.P$2
N$46
  Top 0.152: R36.P$1 C16.2 C17.1
N$47
  Top 0.152: WOODBLOCK_TRIGGER.1 R41.P$2
N$48
  Top 0.152: R35.P$2 15.24,45.72 15.24,41.91 19.05,41.91 20.32,43.18 IC1.13 C16.1 20.32,50.8 22.86,53.34 24.13,53.34 25.4,54.61 25.4,58.42 24.13,59.69 R34.P$1
N$49
  Top 0.152: R43.P$2 27.94,10.16 31.75,10.16 C19.2
  Bottom 0.152: C19.2 34.29,12.7 D6.A
N$50
  Top 0.152: C20.2 D3.A 71.12,27.94 R45.P$2
N$51  (via drill 0.35)
  Top 0.152: Q3.B 87.63,29.84 v87.63,43.18
  Bottom 0.152: v87.63,43.18 87.53,43.28 87.53,46.2 86.26,47.47 82.45,47.47 74.04,55.88 R52.P$2
N$52
  Top 0.152: D8.C 92.71,22.86 92.71,27.94 Q3.C
N$53
  Bottom 0.152: D8.A 91.44,8.89 86.36,3.81 63.5,3.81 R59.P$1 60.96,1.27 55.88,1.27 53.34,3.81 53.34,6.35 52.38,7.32 51.94,7.32 51.64,7.62 25.4,7.62 24.13,8.89 24.13,19.43 23.65,19.91 23.65,23.27 24.13,23.75 24.13,33.4 27.94,37.21 IC1.5
N$54
  Top 0.152: R57.P$1 C24.1 CLING_TRIGGER.2
  Bottom 0.152: R57.P$1 76.2,26.67 R55.P$2
N$55
  Top 0.152: IC2.5 78.74,34.29 | 78.74,34.29 R53.P$2 | D7.C 82.55,34.29 78.74,34.29
N$56
  Top 0.152: CLING_TRIGGER.1 R54.P$2
N$57
  Top 0.152: C24.2 D7.A 83.82,30.48 R56.P$2
N$58
  Top 0.152: LIM_SWITCH1.2 6.35,59.69 7.62,60.96 R6.P$2
N$59
  Bottom 0.152: R49.P$2 40.64,6.35 LIMIT_SWITCH.2
N$60
  Bottom 0.152: LOW_BIT_NOISE.1 53.34,45.72 NOISE_CHIP.9
NOISE
  Top 0.152: NOISE_CHIP.8 58.42,44.45 R33.P$2 R21.P$1
OUT
  Bottom 0.152: JP3.4 87.63,41.91 R30.P$2 IC2.8
RESET  (via drill 0.35)
  Top 0.152: v48.26,46.99 44.45,46.99 FTDI.6
  Bottom 0.152: C4.1 44.45,34.29 45.72,35.56 45.72,39.37 48.26,41.91 v48.26,46.99
RX
  Bottom 0.152: FTDI.5 NOISE_CHIP.12
SNARE_OUT
  Top 0.152: R10.P$1 64.77,43.18 IC2.14 IC2.13
SNARE_TRIGGER
  Bottom 0.152: R20.P$2 36.83,30.48 38.1,31.75 38.1,35.56 44.45,41.91 NOISE_CHIP.13
TX
  Top 0.152: FTDI.4 NOISE_CHIP.11
WB_OUT
  Top 0.152: R24.P$2 C10.2 31.75,58.42 31.75,57.15 34.29,54.61 34.29,49.53 33.02,48.26 IC1.8 34.29,45.72 R9.P$1
WB_TRIGGER
  Top 0.152: NOISE_CHIP.3 R19.P$2